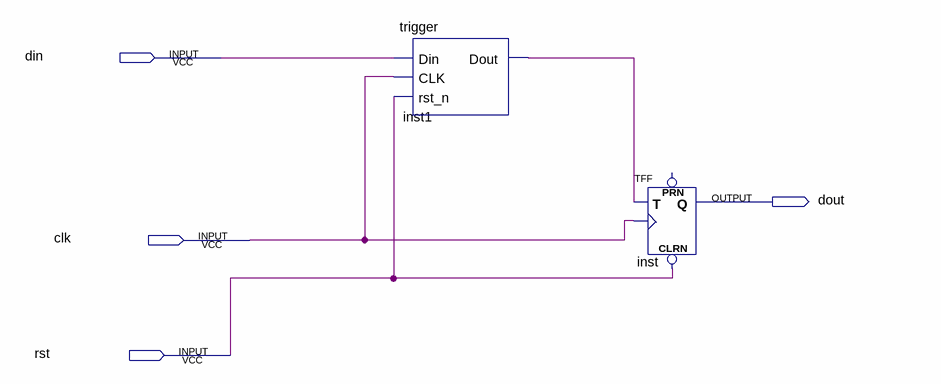
[diagram p0: schematic sheet]
// Quartus schematic tff_XXX.bdf as structural Verilog: 2 symbols, 4 pins
module tff_XXX (
  input  din,
  input  clk,
  input  rst,
  output dout
);

  wire inst1_dout;

  trigger inst1 (.Din(din), .CLK(clk), .rst_n(rst), .Dout(inst1_dout));
  TFF inst (.CLRN(rst), .T(inst1_dout), .CLK(clk), .Q(dout));  // open: PRN
endmodule
